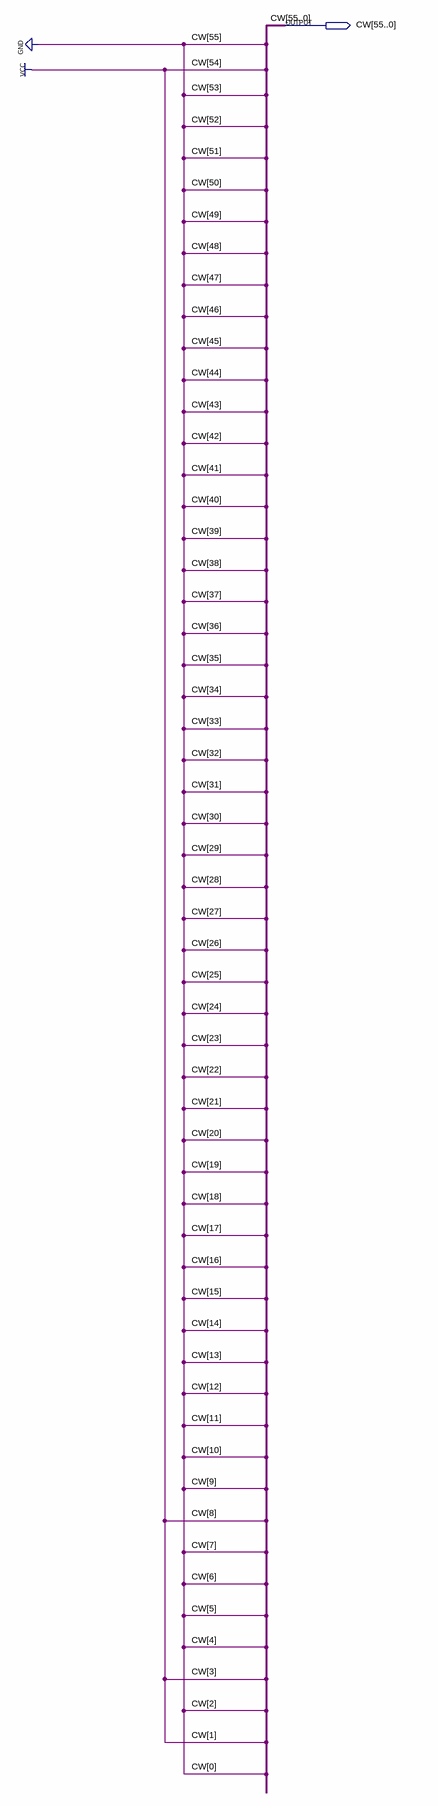
[diagram p0: schematic sheet]
// Quartus schematic InstructionFetch.bdf as structural Verilog: 0 symbols, 1 pins
module InstructionFetch (
  output [55:0] CW
);


  assign CW = 56'b01000000000000000000000000000000000000000000000100001010;
endmodule
